# EAGLE schematic mini_board0 (EAGLE 6.5.0)
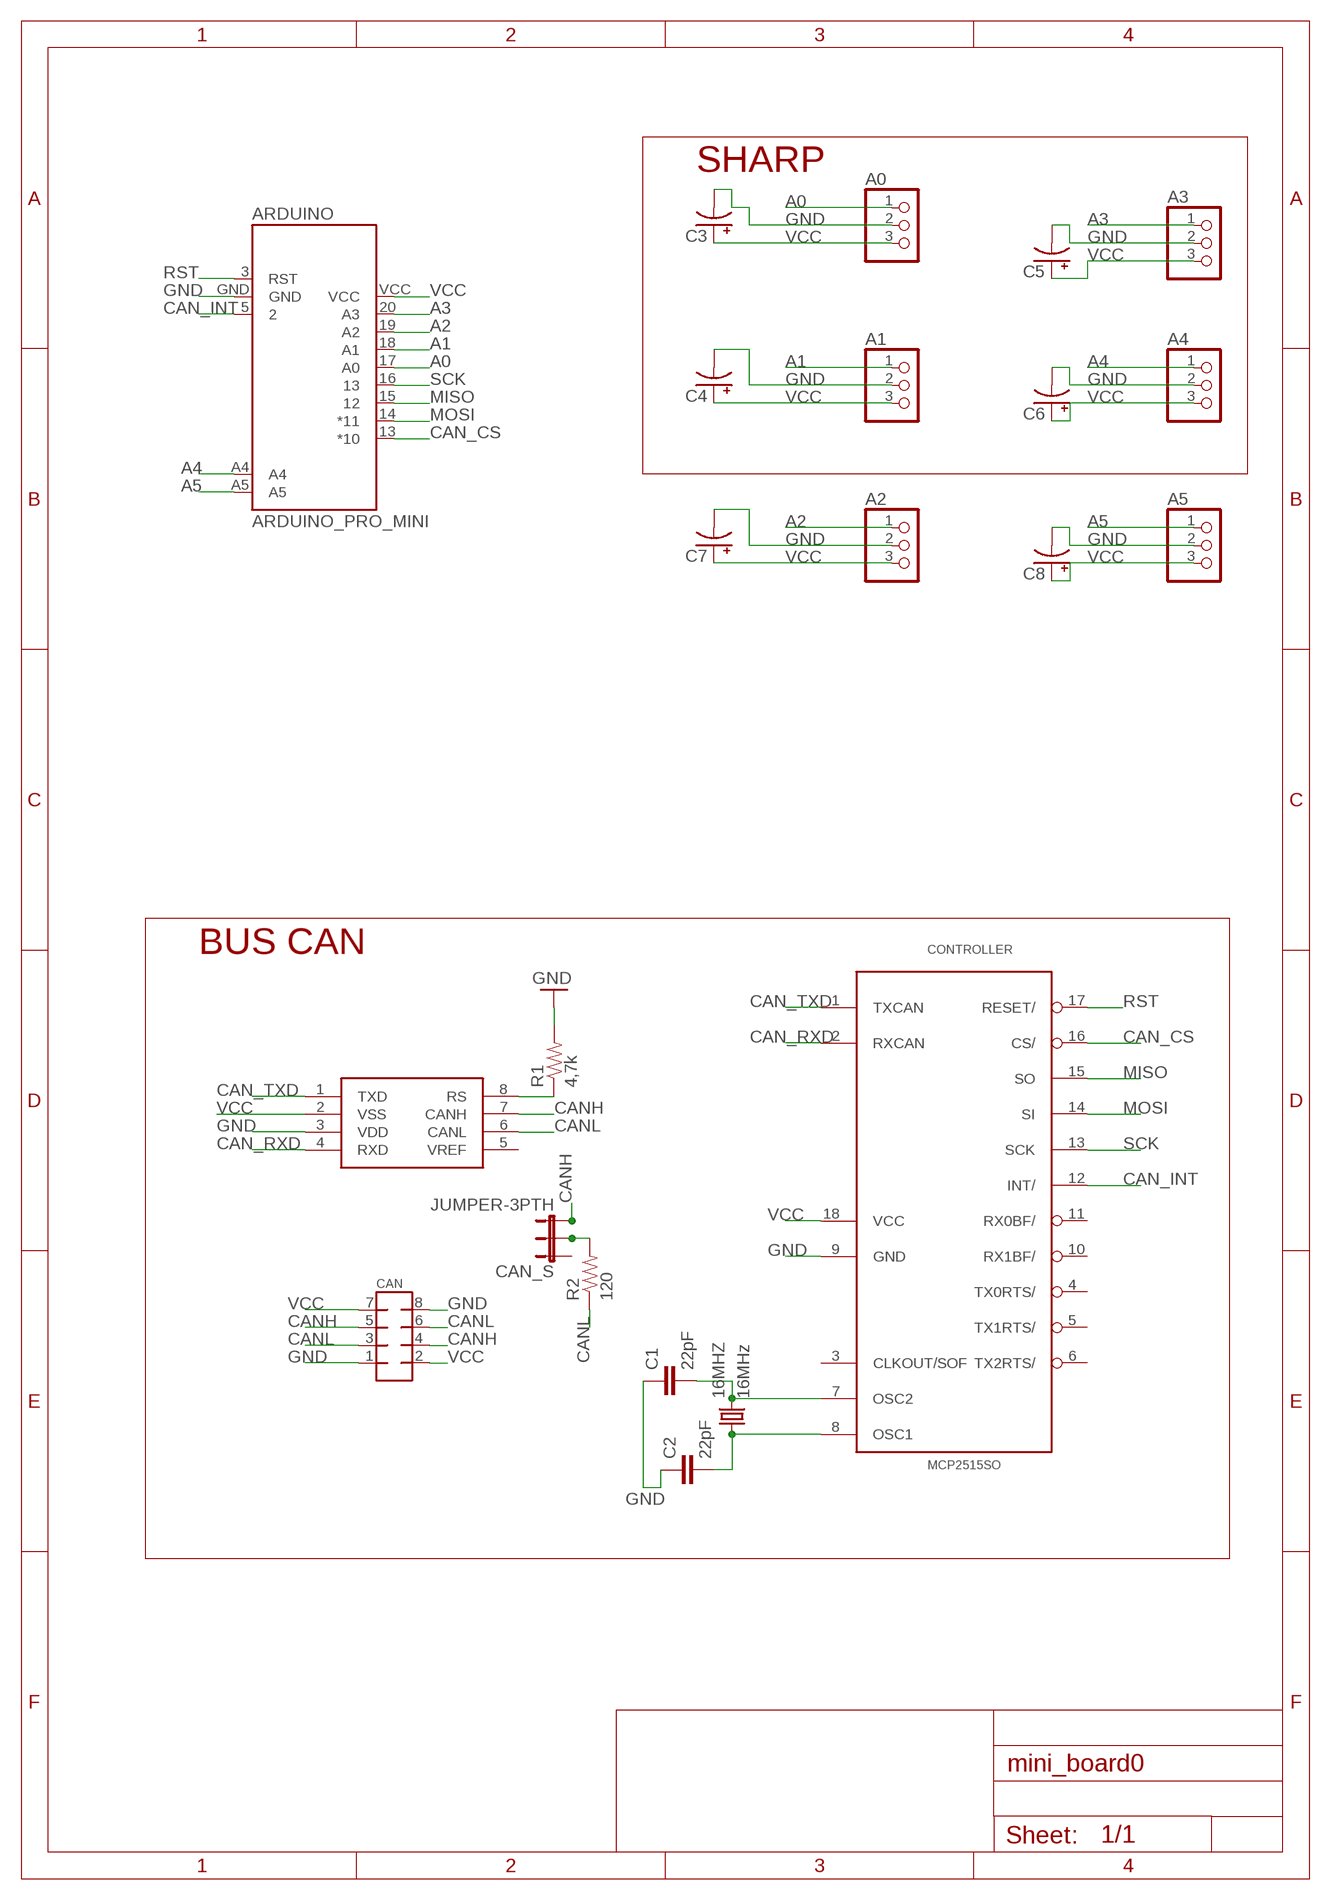
[diagram p0: schematic, sheet 1]

## Parts
16MHZ  16MHz  CRYSTALHC49S  [HC49/S]
A0  PINHD-1X3/90  [1X03/90]
A1  PINHD-1X3/90  [1X03/90]
A2  PINHD-1X3/90  [1X03/90]
A3  PINHD-1X3/90  [1X03/90]
A4  PINHD-1X3/90  [1X03/90]
A5  PINHD-1X3/90  [1X03/90]
ARDUINO  ARDUINO_PRO_MINI  [ARDUINO_PRO_MINI]
C1  22pF  CAP0805  [0805]
C2  22pF  CAP0805  [0805]
C3  CAP_POLPTH2  [CPOL-RADIAL-10UF-25V]
C4  CAP_POLPTH2  [CPOL-RADIAL-10UF-25V]
C5  CAP_POLPTH2  [CPOL-RADIAL-10UF-25V]
C6  CAP_POLPTH2  [CPOL-RADIAL-10UF-25V]
C7  CAP_POLPTH2  [CPOL-RADIAL-10UF-25V]
C8  CAP_POLPTH2  [CPOL-RADIAL-10UF-25V]
CAN  MMATCH-8-PTH  [AMP-215079-8]
CAN_S  JUMPER-3PTH  [1X03]
CONTROLLER  MCP2515SO  [SO18L]
R1  4,7k  RESISTOR0805-RES  [0805]
R2  120  RESISTOR0805-RES  [0805]
U1  MCP2551  [SO08]

## Nets
A0: A0.1 ARDUINO.17(A0)
A1: A1.1 ARDUINO.18(A1)
A2: A2.1 ARDUINO.19(A2)
A3: A3.1 ARDUINO.20(A3)
A4: A4.1 ARDUINO.A4
A5: A5.1 ARDUINO.A5
CAN_CS: ARDUINO.13(*10) CONTROLLER.16(CS/)
CAN_INT: ARDUINO.5 CONTROLLER.12(INT/)
CAN_RXD: CONTROLLER.2(RXCAN) U1.4(RXD)
CAN_TXD: CONTROLLER.1(TXCAN) U1.1(TXD)
CANH: CAN.4 CAN.5 CAN_S.3 U1.7(CANH)
CANL: CAN.3 CAN.6 R2.1 U1.6(CANL)
GND: A0.2 A1.2 A2.2 A3.2 A4.2 A5.2 ARDUINO.GND C1.1 C2.1 C3.2(-) C4.2(-) C5.2(-) C6.2(-) C7.2(-) C8.2(-) CAN.1 CAN.8 CONTROLLER.9(GND) R1.2 U1.3(VDD)
MISO: ARDUINO.15 CONTROLLER.15(SO)
MOSI: ARDUINO.14(*11) CONTROLLER.14(SI)
N$2: 16MHZ.2 C1.2 CONTROLLER.7(OSC2)
N$3: 16MHZ.1 C2.2 CONTROLLER.8(OSC1)
N$5: R1.1 U1.8(RS)
N$7: CAN_S.2 R2.2
RST: ARDUINO.3(RST) CONTROLLER.17(RESET/)
SCK: ARDUINO.16 CONTROLLER.13(SCK)
VCC: A0.3 A1.3 A2.3 A3.3 A4.3 A5.3 ARDUINO.VCC C3.1(+) C4.1(+) C5.1(+) C6.1(+) C7.1(+) C8.1(+) CAN.2 CAN.7 CONTROLLER.18(VCC) U1.2(VSS)
Unconnected: CAN_S.1 CONTROLLER.3(CLKOUT/SOF) CONTROLLER.4(TX0RTS/) CONTROLLER.5(TX1RTS/) CONTROLLER.6(TX2RTS/) CONTROLLER.10(RX1BF/) CONTROLLER.11(RX0BF/) U1.5(VREF)

## Notes on the sheet
- SHARP
- BUS CAN

## Library data of the parts
16MHZ = adafruit:CRYSTAL: CRYSTAL; OC_FARNELL: 1667008; OC_NEWARK: unknown
A0 A1-A5 = pinhead:PINHD-1X3: PIN HEADER
ARDUINO = sharp_shield:ARDUINO_PRO_MINI
C1 C2 = SparkFun-Capacitors:CAP: Capacitor Standard 0603 ceramic capacitor, and 0.1" leaded capacitor.
C3-C8 = SparkFun-Capacitors:CAP_POL: Capacitor Polarized These are standard SMD and PTH capacitors. Normally 10uF, 47uF, and 100uF in electrolytic and tantalum varieties. Always verify the external diameter of the through hole cap, it varies with capacity, voltage, and manufacturer. The EIA devices should be standard.
CAN = jt-con-micromatch:MMATCH-8-*: AMP Micromatch 8-pin
CAN_S = SparkFun-Passives:JUMPER-3
CONTROLLER = MCP2515_MT:MCP2515*: MCP2515 Standalone CAN-Controller by Microchip Eagle-Lib. by MartinThomas
R1 R2 = SparkFun-Passives:RESISTOR: Resistor Basic schematic elements and footprints for 0603, 1206, and PTH resistors.
U1 = SparkFun-DigitalIC:MCP2551: CAN transceiver

## Net classes
0 default: clearance 0.205 mm